# Altium schematic sheet CCSolenoidDriver.SchDoc
size A4; SheetNumber: 13; SheetTotal: 13
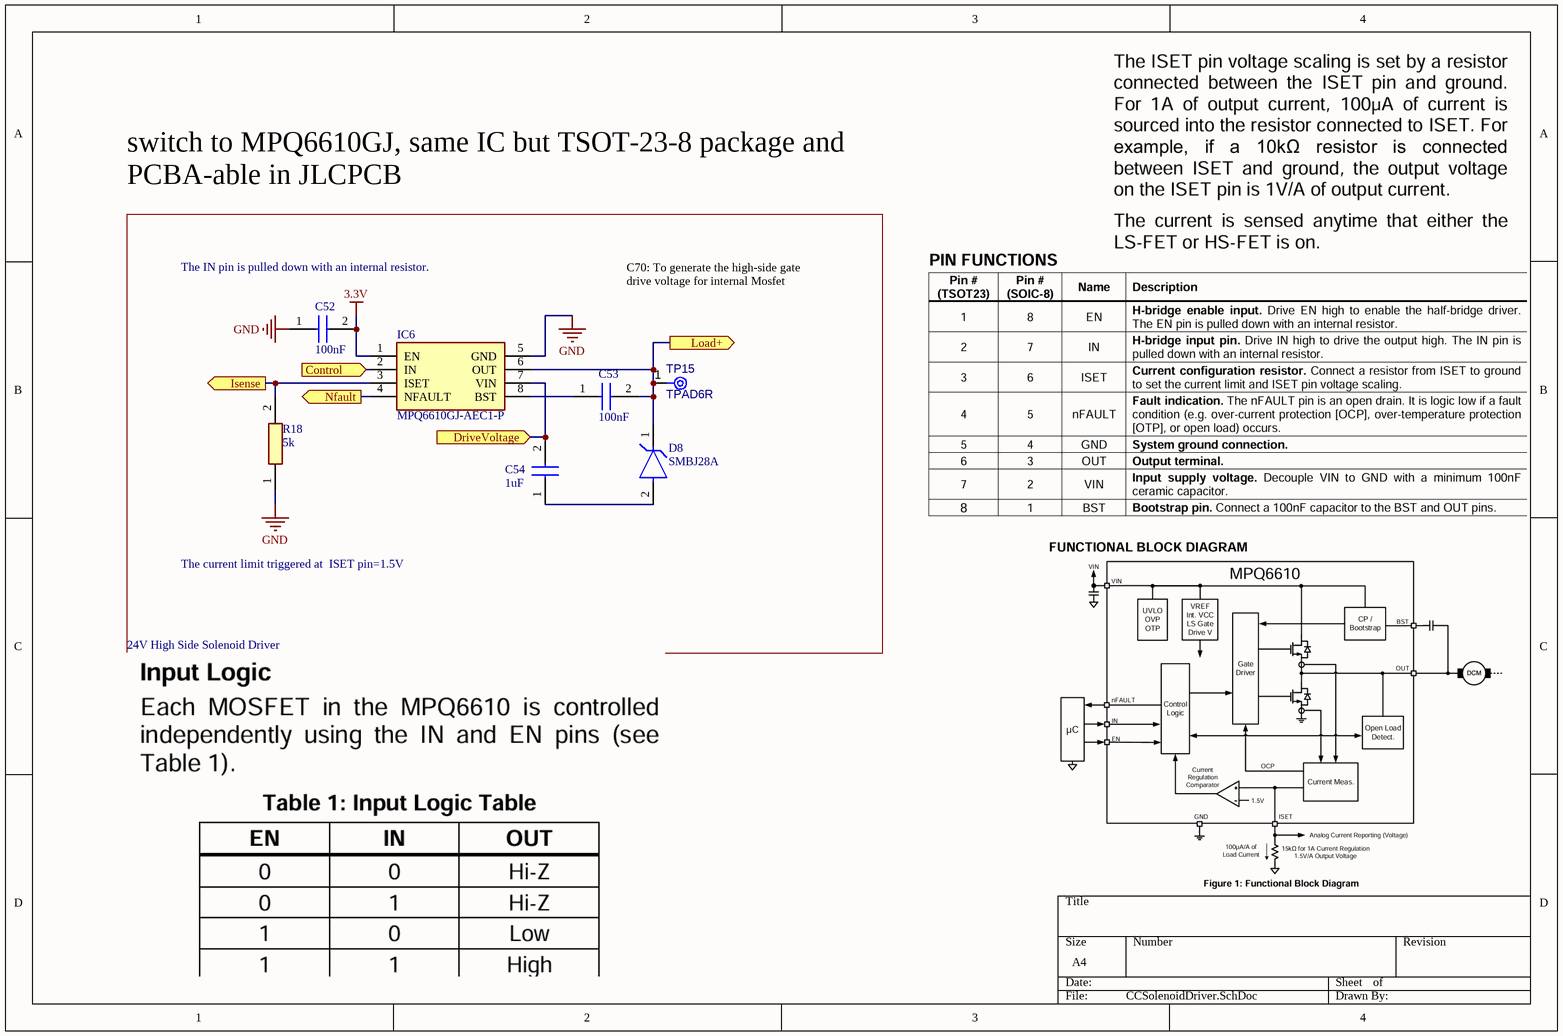
[diagram p0: CCSolenoidDriver.SchDoc]

## Parts
C52  100nF  [CAPC1608X90N]
C53  100nF  [CAPC1608X90N]
C54  1uF  [CAPC3216X180N]
D8  SMBJ28A  [FP-SMBJ-MFG]
IC6  MPQ6610GJ-AEC1-P  [SOT65P280X100-8N]
R18  5k  [RESC1608X55N]
TP15  TPAD6R  [TP06R]  (no BOM)

## Ports
Control (in), DriveVoltage (in), Isense (out), Load+ (out), Nfault (out)

## Nets
3.3V: C52.2 IC6.1(EN)
GND: C52.1 IC6.5(GND) R18.1
Control: IC6.2(IN) ; port Control
DriveVoltage: C54.2 IC6.7(VIN) ; port DriveVoltage
Isense: IC6.3(ISET) R18.2 ; port Isense
Load+: C53.2 D8.1(C) IC6.6(OUT) TP15.1(TP) ; port Load+
Nfault: IC6.4(NFAULT) ; port Nfault
NetC53_1: C53.1 IC6.8(BST)
NetC54_1: C54.1 D8.2(A)

## Notes on the sheet
- switch to MPQ6610GJ, same IC but TSOT-23-8 package and PCBA-able in JLCPCB
- The IN pin is pulled down with an internal resistor.
- C70: To generate the high-side gate drive voltage for internal Mosfet
- The current limit triggered at  ISET pin=1.5V
- 24V High Side Solenoid Driver

## Library data of the parts
C52 C53 = CC0603KRX7R9BB104: Capacitor,0603, 50V; Manufacturer_Name: YAGEO; Datasheet Link: https://componentsearchengine.com/Datasheets/2/CC0603KRX7R9BB104.pdf; Height: 0.9mm; Manufacturer_Part_Number: CC0603KRX7R9BB104; Mouser Part Number: 603-CC603KRX7R9BB104; Mouser Price/Stock: https://www.mouser.co.uk/ProductDetail/YAGEO/CC0603KRX7R9BB104?qs=vTakOoo5QyLvVCYM2ge8LQ%3D%3D; Arrow Part Number: CC0603KRX7R9BB104; Arrow Price/Stock: https://www.arrow.com/en/products/cc0603krx7r9bb104/yageo?utm_currency=USD&region=europe
C54 = CL31B105KBHNNNE: 1uF,1206, 50v; Manufacturer_Name: SAMSUNG; Datasheet Link: https://datasheet.datasheetarchive.com/originals/distributors/Datasheets_SAMA/5cd9a1c15dad09a7278f50cb1a2e4a6e.pdf; Height: 1.8mm; Manufacturer_Part_Number: CL31B105KBHNNNE; Mouser Part Number: 187-CL31B105KBHNNNE; Mouser Price/Stock: https://www.mouser.co.uk/ProductDetail/Samsung-Electro-Mechanics/CL31B105KBHNNNE?qs=349EhDEZ59oPJzVuH4J5mw%3D%3D; Arrow Part Number: CL31B105KBHNNNE; Arrow Price/Stock: https://www.arrow.com/en/products/cl31b105kbhnnne/samsung-electro-mechanics?utm_currency=USD&region=europe
D8 = CMP-08607-000081-1: TVS DIODE 28V 45.4V DO214AA; Manufacturer: Littelfuse Inc; Breakdown Voltage: 31.1V; Direction: Unidirectional; Number Of Channels: 1; Peak Pulse Power: 600W; Max Junction Temp: +150°C; Peak Pulse Current: 13.3A; Temperature: -65°C to +150°C; Category: Diode; RoHS: TRUE; Height: 2.61mm; Reverse Standoff Voltage: 28V; Device Class L1: Circuit Protection; Temperature Range Low: -65°C; ComponentLink2Description: Datasheet; Digikey Description: TVS DIODE 28V 45.4V DO214AA; Automotive: No; Package: SMBJ; Mouser Description: Littelfuse SMBJ28A, Uni-Directional TVS Diode, 600W, 2-Pin DO-214AA; ComponentLink2URL: https://www.littelfuse.com/~/media/electronics/datasheets/tvs_diodes/littelfuse_tvs_diode_smbj_datasheet.pdf.pdf; Manufacturer Part Number: SMBJ28A; Octopart: https://octopart.com/smbj28a-littelfuse-350790; Clamping Voltage: 45.4V; Temperature Range High: +150°C; Device Class L3: unset; Device Class L2: TVS Diodes; Lead Free: Yes
IC6 = CMP-031-00027-1: Integrated Circuit; Manufacturer_Name: Monolithic Power Systems (MPS); Height: 1mm; Manufacturer_Part_Number: MPQ6610GJ-AEC1-P; Design Item ID: MPQ6610GJ-AEC1-P; Datasheet Link: https://www.monolithicpower.com/en/documentview/productdocument/index/version/2/document_type/Datasheet/lang/en/sku/MPQ6610-AEC1/document_id/9806/; Source: SamacSys.SchLib
R18 = 0603WAF5101T5E: 0603 5K resistor, Pick based component in JLCPCB lib; Manufacturer_Name: UNI-ROYAL(Uniroyal Elec); Datasheet Link: https://datasheet.lcsc.com/szlcsc/Uniroyal-Elec-0603WAF5101T5E_C23186.pdf; Height: 0.55mm; Manufacturer_Part_Number: 0603WAF5101T5E
TP15 = CMP-00028-00002-2: 0.6mm round; Pins: 1